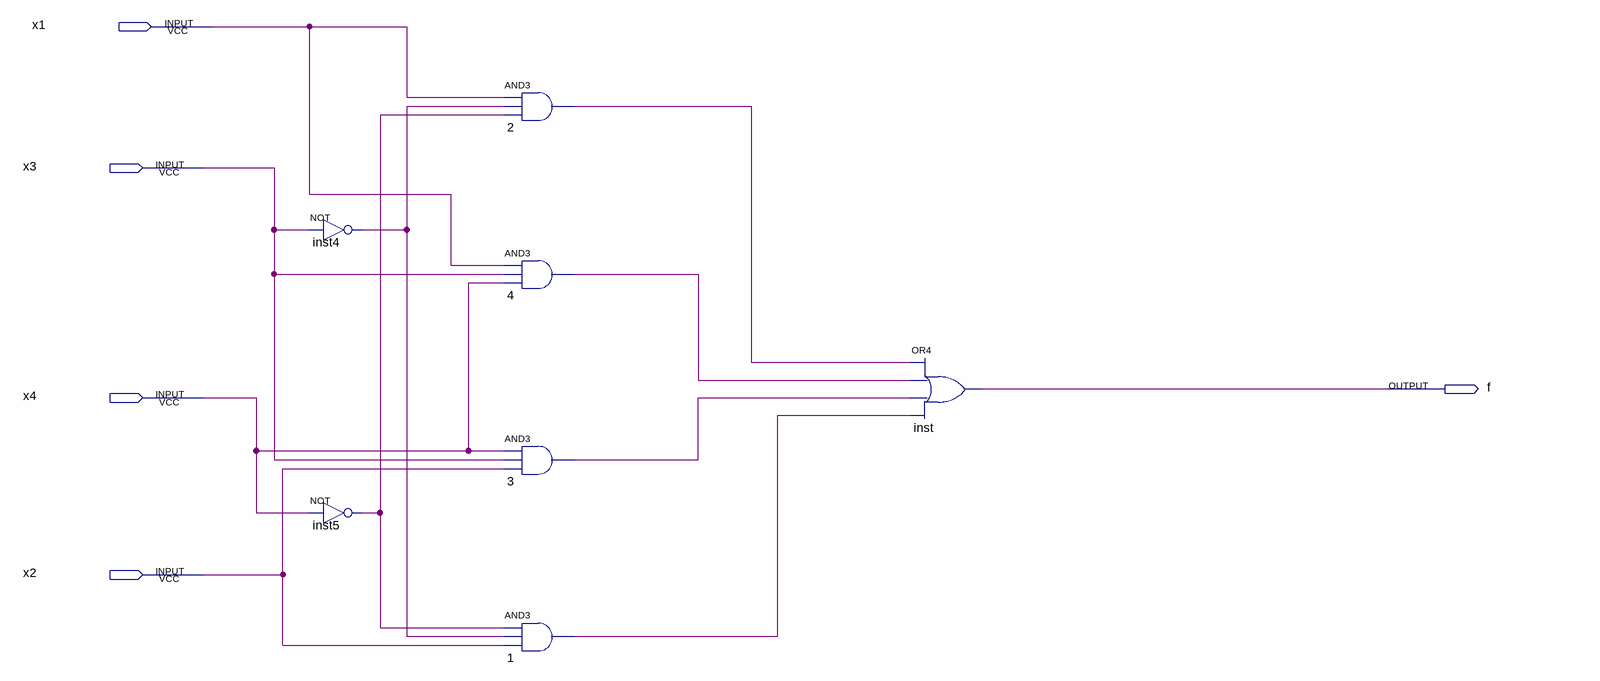
[diagram p0: schematic sheet]
// Quartus schematic lab3.bdf as structural Verilog: 7 symbols, 5 pins
module lab3 (
  input  x1,
  input  x3,
  input  x4,
  input  x2,
  output f
);

  wire inst4_out, inst5_out, n1_out, n2_out, n3_out, n4_out;

  not inst4 (inst4_out, x3);
  not inst5 (inst5_out, x4);
  and u_2 (n2_out, x1, inst4_out, inst5_out);
  and u_4 (n4_out, x1, x3, x4);
  and u_3 (n3_out, x4, x3, x2);
  and u_1 (n1_out, inst5_out, inst4_out, x2);
  or inst (f, n2_out, n4_out, n3_out, n1_out);
endmodule
